# Altium schematic sheet Drivers.SchDoc
size 457 x 304 mm
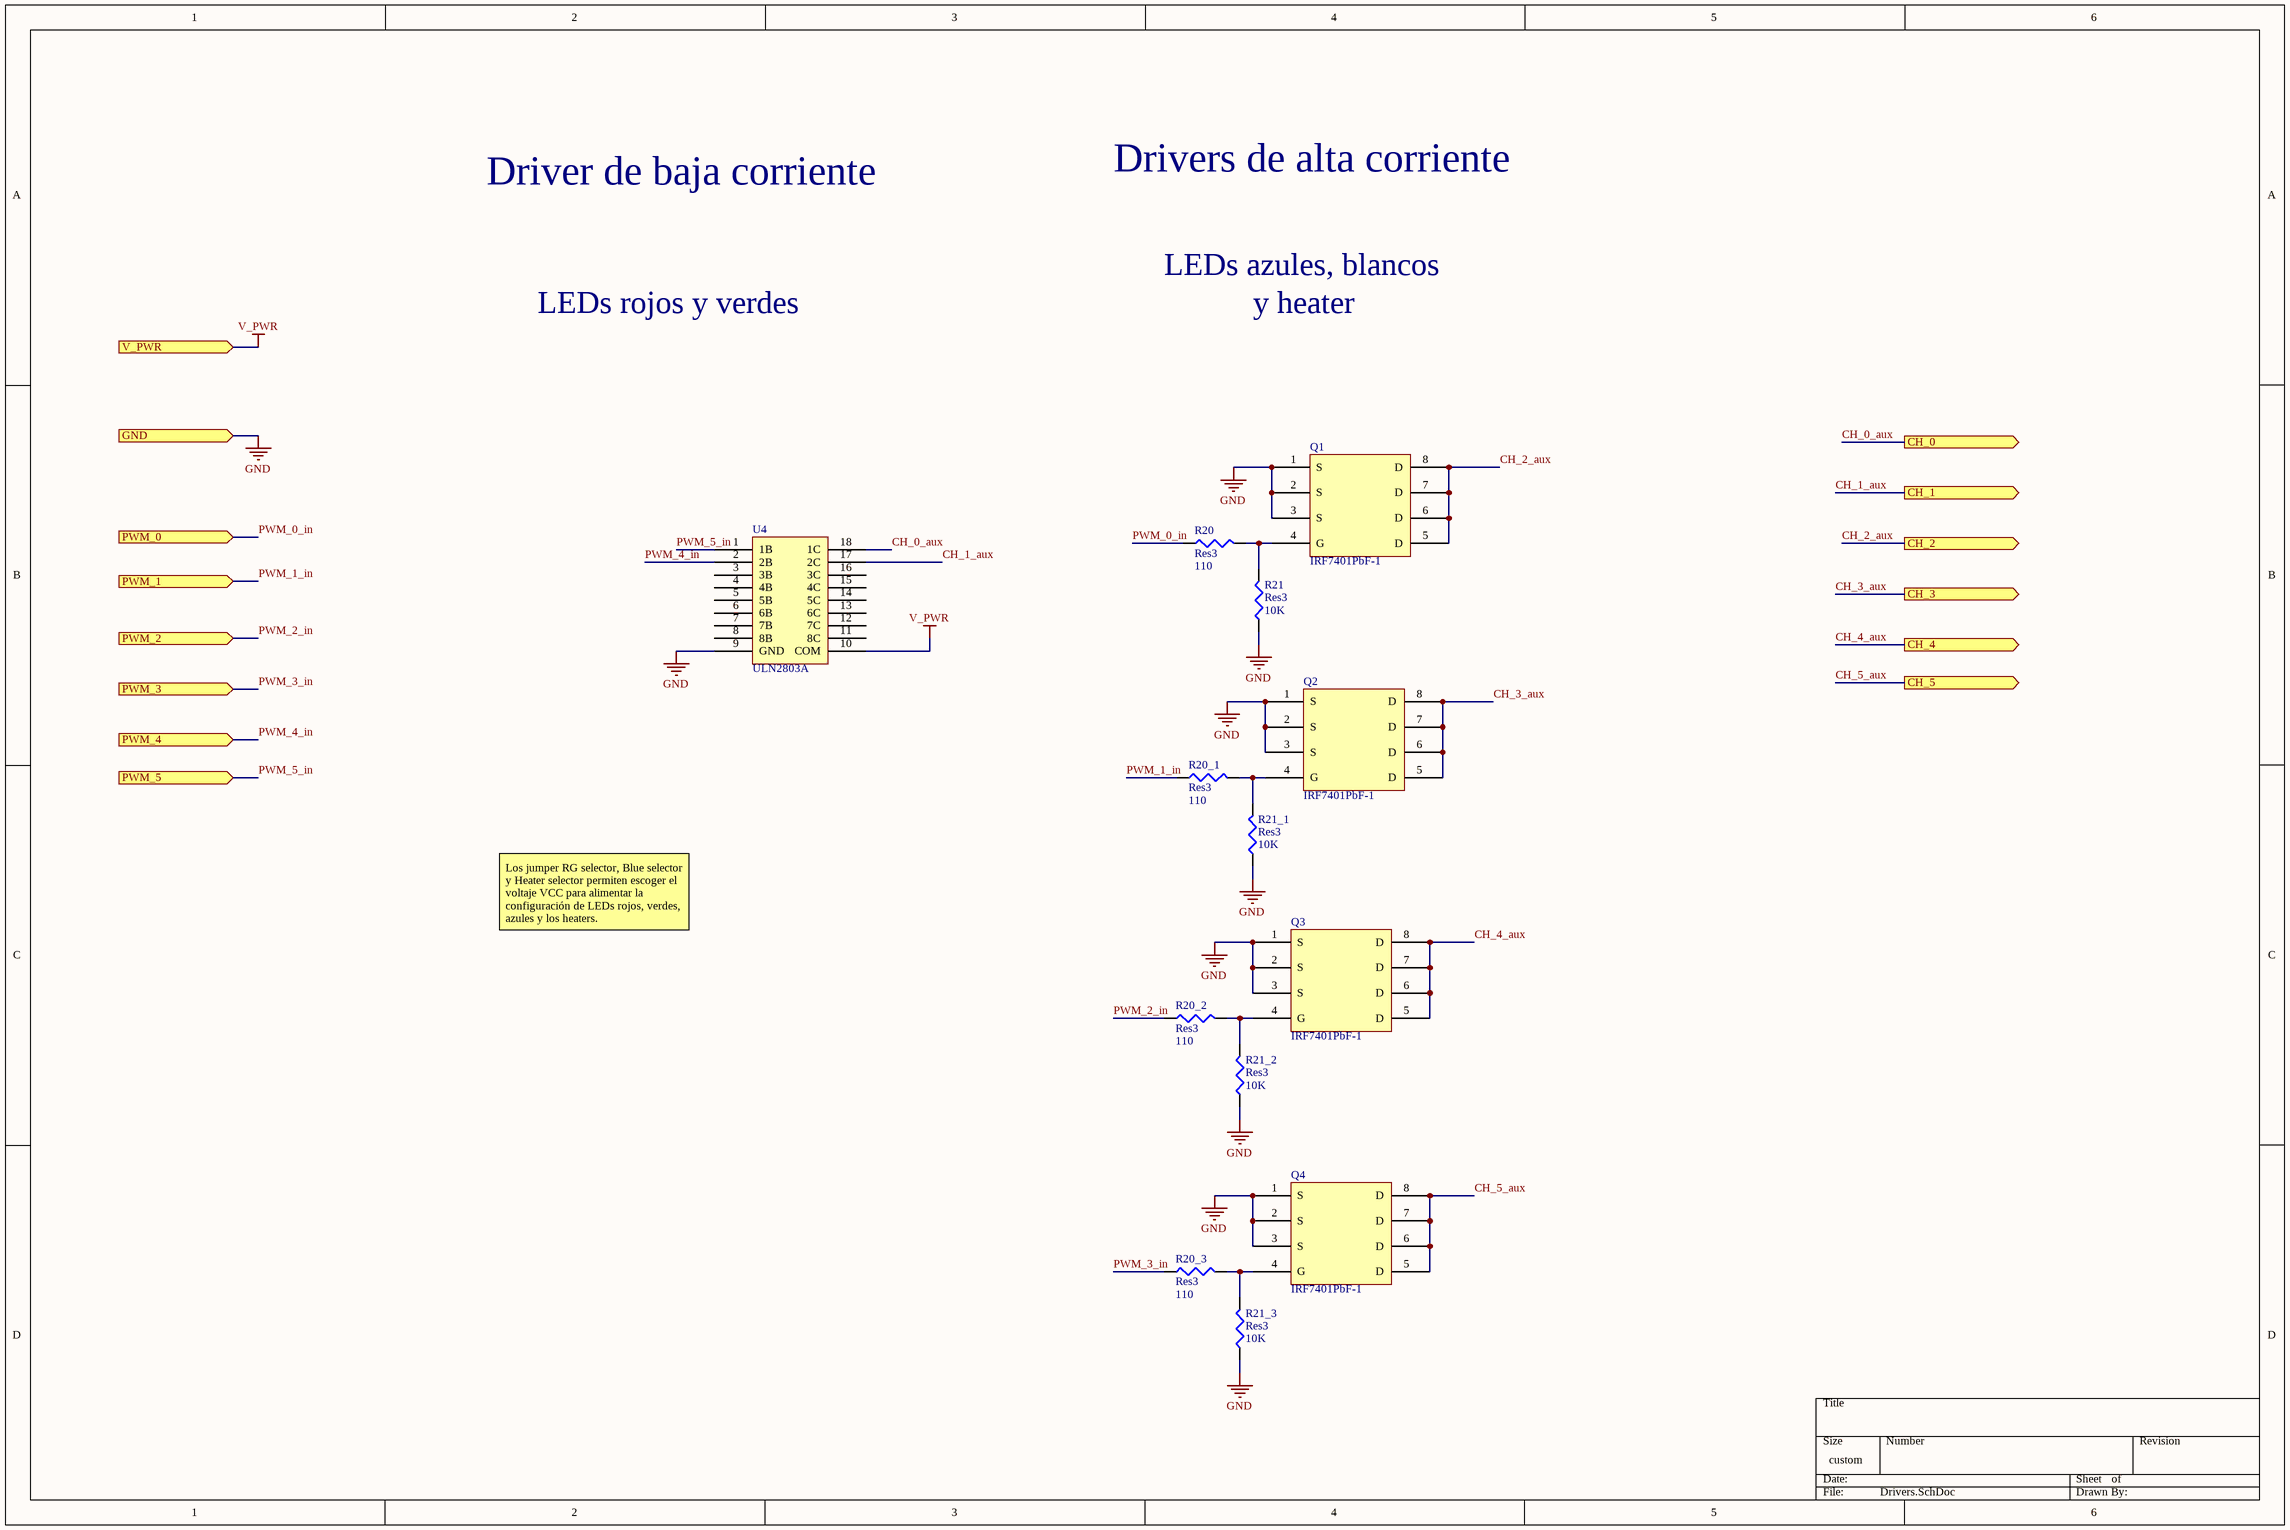
[diagram p0: Drivers.SchDoc]

## Parts
Q1  IRF7401PbF-1  [SOIC8]
Q2  IRF7401PbF-1  [SOIC8]
Q3  IRF7401PbF-1  [SOIC8]
Q4  IRF7401PbF-1  [SOIC8]
R20  Res3  value 110  [J1-0603]
R20_1  Res3  value 110  [J1-0603]
R20_2  Res3  value 110  [J1-0603]
R20_3  Res3  value 110  [J1-0603]
R21  Res3  value 10K  [J1-0603]
R21_1  Res3  value 10K  [J1-0603]
R21_2  Res3  value 10K  [J1-0603]
R21_3  Res3  value 10K  [J1-0603]
U4  ULN2803A  [SOIC18]

## Ports
CH_0 (out), CH_1 (out), CH_2 (out), CH_3 (out), CH_4 (out), CH_5 (out), GND (in), PWM_0 (in), PWM_1 (in), PWM_2 (in), PWM_3 (in), PWM_4 (in), PWM_5 (in), V_PWR (in)

## Nets
GND: Q1.1(S) Q1.2(S) Q1.3(S) Q2.1(S) Q2.2(S) Q2.3(S) Q3.1(S) Q3.2(S) Q3.3(S) Q4.1(S) Q4.2(S) Q4.3(S) R21.1 R21_1.1 R21_2.1 R21_3.1 U4.9(GND) ; port GND
V_PWR: U4.10(COM) ; port V_PWR
CH_0_aux: U4.18(1C) ; port CH_0
CH_1_aux: U4.17(2C) ; port CH_1
CH_2_aux: Q1.5(D) Q1.6(D) Q1.7(D) Q1.8(D) ; port CH_2
CH_3_aux: Q2.5(D) Q2.6(D) Q2.7(D) Q2.8(D) ; port CH_3
CH_4_aux: Q3.5(D) Q3.6(D) Q3.7(D) Q3.8(D) ; port CH_4
CH_5_aux: Q4.5(D) Q4.6(D) Q4.7(D) Q4.8(D) ; port CH_5
PWM_0_in: R20.1 ; port PWM_0
PWM_1_in: R20_1.1 ; port PWM_1
PWM_2_in: R20_2.1 ; port PWM_2
PWM_3_in: R20_3.1 ; port PWM_3
PWM_4_in: U4.2(2B) ; port PWM_4
PWM_5_in: U4.1(1B) ; port PWM_5
NetQ1_4: Q1.4(G) R20.2 R21.2
NetQ2_4: Q2.4(G) R20_1.2 R21_1.2
NetQ3_4: Q3.4(G) R20_2.2 R21_2.2
NetQ4_4: Q4.4(G) R20_3.2 R21_3.2

Not connected (* = marked no-connect by the designer): U4 3(3B) 4(4B) 5(5B) 6(6B) 7(7B) 8(8B) 11(8C) 12(7C) 13(6C) 14(5C) 15(4C) 16(3C)

## Notes on the sheet
- Driver de baja corriente
- Drivers de alta corriente
- LEDs azules, blancos
- LEDs rojos y verdes
- y heater
- Los jumper RG selector, Blue selector y Heater selector permiten escoger el voltaje VCC para alimentar la configuración de LEDs rojos, verdes, azules y los heaters.

## Library data of the parts
Q1-Q4 = IRF7401: MOSFET N Channel 20V 8.7A 700mV @ 250uA 22mΩ @ 4.1A,4.5V SOIC-8_150mil RoHS; Manufacturer: Infineon Technologies; Manufacturer Part Number: IRF7401TRPBF; Description: 6.8A 2.5W 20V 0.035Ω 4.1A,4.5V N Channel 0.7V 250uA SOIC-8_150mil MOSFETs ROHS; Package: SO-8; Supplier 1: LCSC; Supplier Part Number 1: C169089
R20 R20_1-R20_3 = Res3: Resistor; Manufacturer: ROHM Semicon; Manufacturer Part Number: MCR03EZPFX1100; Description: ±1% 110Ω ±100ppm/℃ 0.1W 0603 Chip Resistor - Surface Mount ROHS; Published: 8-Jun-2000; LatestRevisionDate: 29-May-2009; LatestRevisionNote: IPC-7351 Footprint Added.; PackageReference: J1-0603; Publisher: Altium Limited; PackageDescription: Chip Resistor; Supplier 1: LCSC; Supplier Part Number 1: C22781
R21 R21_1-R21_3 = Res3: Resistor; Manufacturer: PANASONIC; Manufacturer Part Number: ERJPA3F1002V; Description: ±1% 2kΩ ±100ppm/℃ 0.1W 0603 Chip Resistor - Surface Mount ROHS; Published: 8-Jun-2000; LatestRevisionDate: 29-May-2009; LatestRevisionNote: IPC-7351 Footprint Added.; PackageReference: J1-0603; Publisher: Altium Limited; PackageDescription: Chip Resistor; Supplier 1: LCSC; Supplier Part Number 1: C25804
U4 = ULN2803: Darlington transistor array driver SOIC-18_300mi; Manufacturer: Texas instrument; Manufacturer Part Number: ULN2803ADWR; Description: SOIC-18_300mil Darlington Transistor Arrays ROHS; Supplier 1: LCSC; Supplier Part Number 1: C33924; Package: SOIC-18_300mil